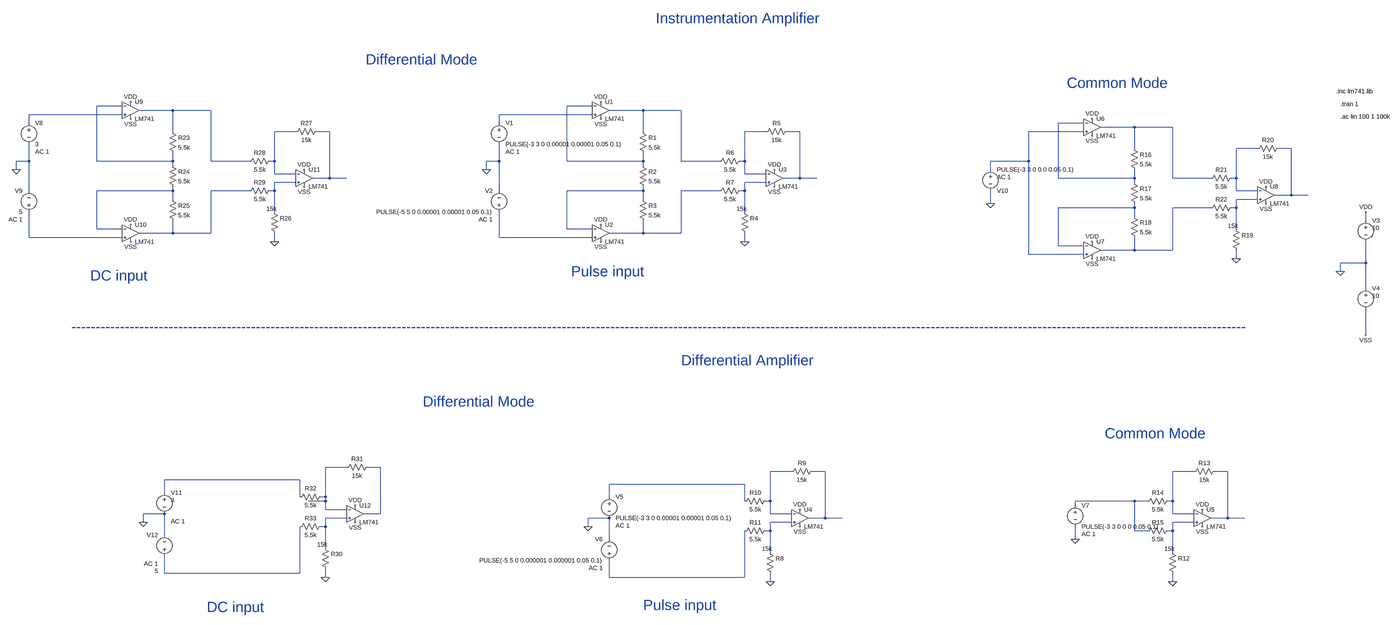
[diagram p0: schematic intrumentation amp.asc, whole sheet]
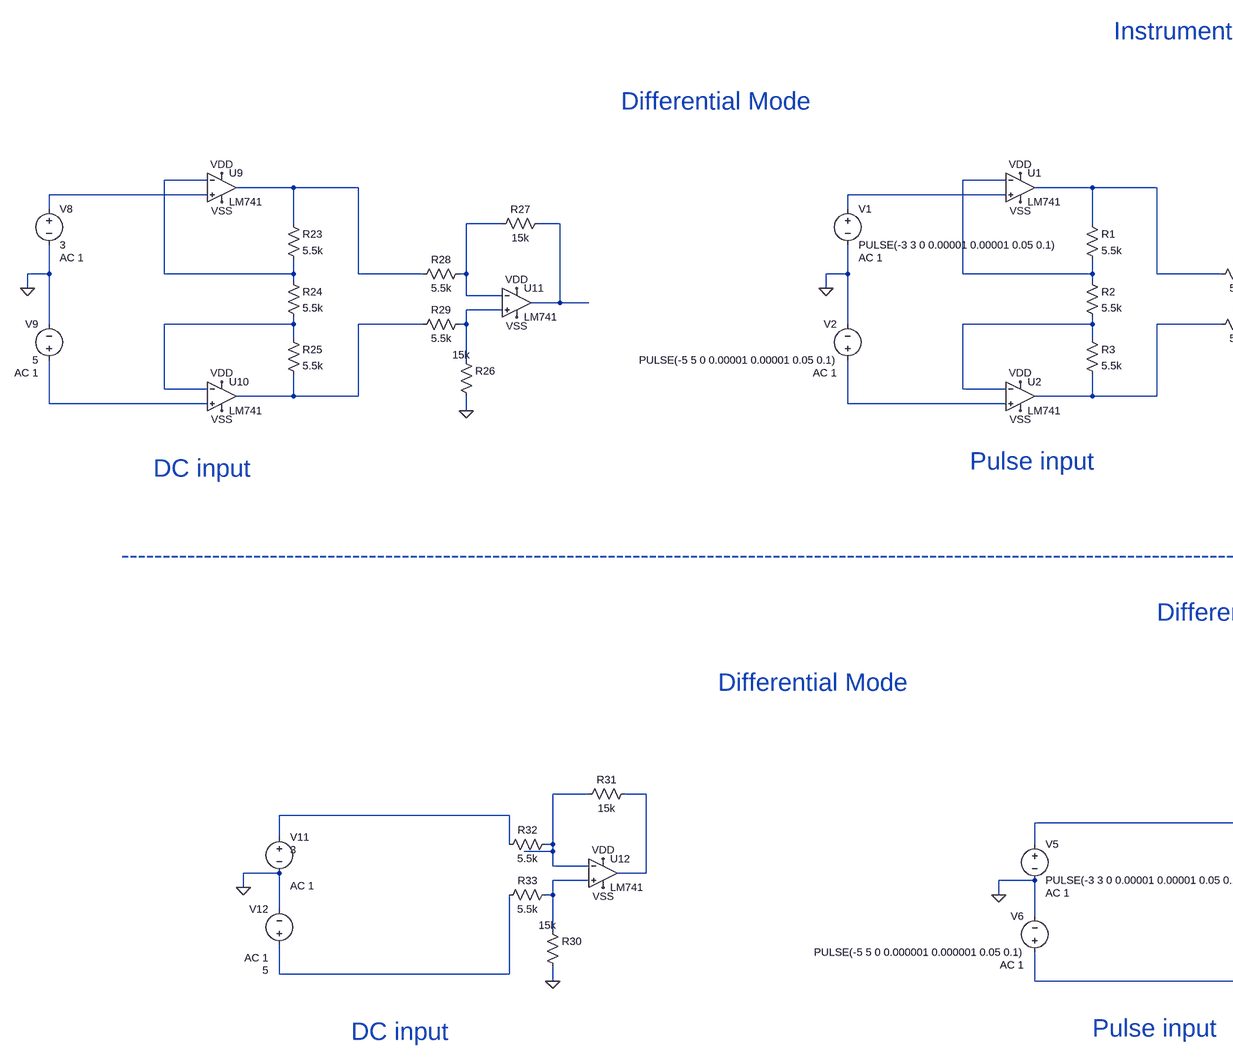
[diagram p1: schematic intrumentation amp.asc, part, row 1 of 1, column 1 of 2]
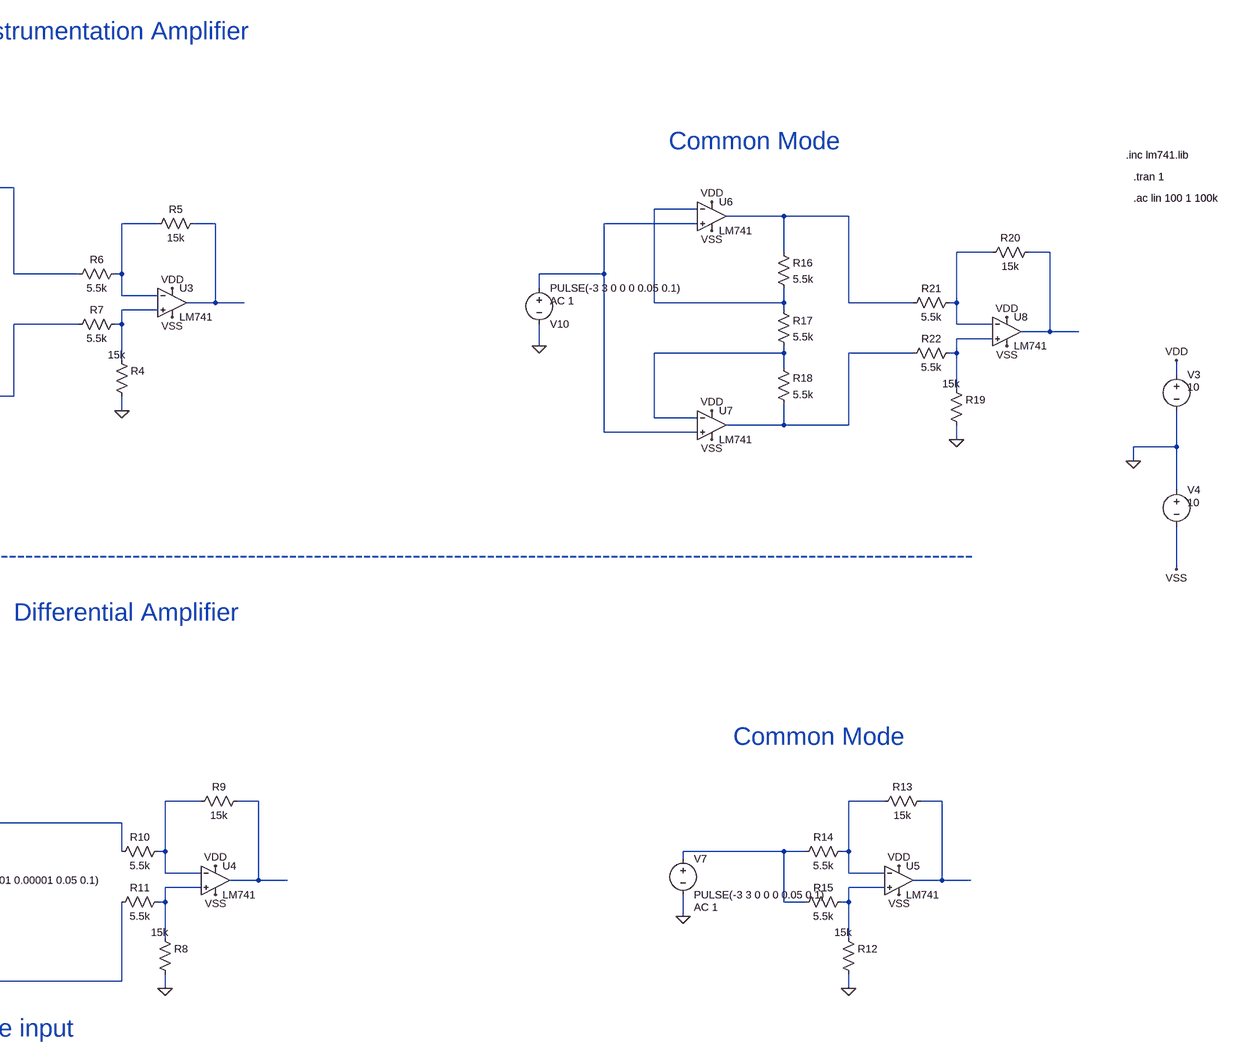
[diagram p2: schematic intrumentation amp.asc, part, row 1 of 1, column 2 of 2]
intrumentation amp.asc, the LTspice schematic file:
Version 4
SHEET 1 4928 2164
WIRE -1456 128 -1552 128
WIRE 320 128 224 128
WIRE -1264 144 -1392 144
WIRE -1120 144 -1264 144
WIRE 512 144 384 144
WIRE 656 144 512 144
WIRE -1456 160 -1808 160
WIRE 320 160 -32 160
WIRE -1808 192 -1808 160
WIRE -32 192 -32 160
WIRE 2176 192 2080 192
WIRE 2368 208 2240 208
WIRE 2512 208 2368 208
WIRE -1264 224 -1264 144
WIRE -800 224 -880 224
WIRE -672 224 -720 224
WIRE 512 224 512 144
WIRE 976 224 896 224
WIRE 1104 224 1056 224
WIRE 2176 224 1968 224
WIRE 2368 288 2368 208
WIRE 2832 288 2752 288
WIRE 2960 288 2912 288
WIRE -1808 336 -1808 272
WIRE -1808 336 -1856 336
WIRE -1552 336 -1552 128
WIRE -1264 336 -1264 304
WIRE -1264 336 -1552 336
WIRE -1120 336 -1120 144
WIRE -976 336 -1120 336
WIRE -880 336 -880 224
WIRE -880 336 -896 336
WIRE -32 336 -32 272
WIRE -32 336 -80 336
WIRE 224 336 224 128
WIRE 512 336 512 304
WIRE 512 336 224 336
WIRE 656 336 656 144
WIRE 800 336 656 336
WIRE 896 336 896 224
WIRE 896 336 880 336
WIRE 1968 336 1968 224
WIRE 1968 336 1824 336
WIRE -1264 352 -1264 336
WIRE 512 352 512 336
WIRE -1856 368 -1856 336
WIRE -80 368 -80 336
WIRE 1824 368 1824 336
WIRE -880 384 -880 336
WIRE -800 384 -880 384
WIRE 896 384 896 336
WIRE 976 384 896 384
WIRE -672 400 -672 224
WIRE -672 400 -736 400
WIRE -608 400 -672 400
WIRE 1104 400 1104 224
WIRE 1104 400 1040 400
WIRE 1168 400 1104 400
WIRE 2080 400 2080 192
WIRE 2368 400 2368 368
WIRE 2368 400 2080 400
WIRE 2512 400 2512 208
WIRE 2656 400 2512 400
WIRE 2752 400 2752 288
WIRE 2752 400 2736 400
WIRE -800 416 -880 416
WIRE 976 416 896 416
WIRE 2368 416 2368 400
WIRE -1808 448 -1808 336
WIRE -1264 448 -1264 432
WIRE -1264 448 -1552 448
WIRE -976 448 -1120 448
WIRE -880 448 -880 416
WIRE -880 448 -896 448
WIRE -32 448 -32 336
WIRE 512 448 512 432
WIRE 512 448 224 448
WIRE 800 448 656 448
WIRE 896 448 896 416
WIRE 896 448 880 448
WIRE 2752 448 2752 400
WIRE 2832 448 2752 448
WIRE 2960 464 2960 288
WIRE 2960 464 2896 464
WIRE 3024 464 2960 464
WIRE -1264 480 -1264 448
WIRE 512 480 512 448
WIRE 2832 480 2752 480
WIRE 1824 496 1824 448
WIRE 2368 512 2368 496
WIRE 2368 512 2080 512
WIRE 2656 512 2512 512
WIRE 2752 512 2752 480
WIRE 2752 512 2736 512
WIRE -880 528 -880 448
WIRE 896 528 896 448
WIRE 2368 544 2368 512
WIRE 3408 560 3408 528
WIRE -1552 592 -1552 448
WIRE -1456 592 -1552 592
WIRE 224 592 224 448
WIRE 320 592 224 592
WIRE 2752 592 2752 512
WIRE -1264 608 -1264 560
WIRE -1264 608 -1392 608
WIRE -1120 608 -1120 448
WIRE -1120 608 -1264 608
WIRE 512 608 512 560
WIRE 512 608 384 608
WIRE 656 608 656 448
WIRE 656 608 512 608
WIRE -1808 624 -1808 528
WIRE -1456 624 -1808 624
WIRE -32 624 -32 528
WIRE 320 624 -32 624
WIRE -880 640 -880 608
WIRE 896 640 896 608
WIRE 2080 656 2080 512
WIRE 2176 656 2080 656
WIRE 2368 672 2368 624
WIRE 2368 672 2240 672
WIRE 2512 672 2512 512
WIRE 2512 672 2368 672
WIRE 1968 688 1968 336
WIRE 2176 688 1968 688
WIRE 2752 704 2752 672
WIRE 3408 720 3408 640
WIRE 3408 720 3312 720
WIRE 3312 752 3312 720
WIRE 3408 816 3408 720
WIRE 3408 992 3408 896
WIRE -608 1600 -688 1600
WIRE -480 1600 -528 1600
WIRE 1072 1616 992 1616
WIRE 1200 1616 1152 1616
WIRE 2592 1616 2512 1616
WIRE 2720 1616 2672 1616
WIRE -784 1648 -1296 1648
WIRE 896 1664 384 1664
WIRE -1296 1696 -1296 1648
WIRE -784 1712 -784 1648
WIRE -688 1712 -688 1600
WIRE -688 1712 -704 1712
WIRE 384 1712 384 1664
WIRE -688 1728 -688 1712
WIRE -688 1728 -752 1728
WIRE 896 1728 896 1664
WIRE 992 1728 992 1616
WIRE 992 1728 976 1728
WIRE 2368 1728 2144 1728
WIRE 2416 1728 2368 1728
WIRE 2512 1728 2512 1616
WIRE 2512 1728 2496 1728
WIRE 2144 1744 2144 1728
WIRE -688 1760 -688 1728
WIRE -608 1760 -688 1760
WIRE -1296 1776 -1376 1776
WIRE -480 1776 -480 1600
WIRE -480 1776 -544 1776
WIRE 992 1776 992 1728
WIRE 1072 1776 992 1776
WIRE 2512 1776 2512 1728
WIRE 2592 1776 2512 1776
WIRE -608 1792 -688 1792
WIRE 384 1792 304 1792
WIRE 1200 1792 1200 1616
WIRE 1200 1792 1136 1792
WIRE 1264 1792 1200 1792
WIRE 2720 1792 2720 1616
WIRE 2720 1792 2656 1792
WIRE 2784 1792 2720 1792
WIRE -1376 1808 -1376 1776
WIRE 1072 1808 992 1808
WIRE 2592 1808 2512 1808
WIRE -688 1824 -688 1792
WIRE -688 1824 -704 1824
WIRE 304 1824 304 1792
WIRE 992 1840 992 1808
WIRE 992 1840 976 1840
WIRE 2368 1840 2368 1728
WIRE 2416 1840 2368 1840
WIRE 2512 1840 2512 1808
WIRE 2512 1840 2496 1840
WIRE -1296 1856 -1296 1776
WIRE 384 1872 384 1792
WIRE 2144 1872 2144 1824
WIRE -688 1904 -688 1824
WIRE 992 1920 992 1840
WIRE 2512 1920 2512 1840
WIRE -1296 2000 -1296 1936
WIRE -784 2000 -784 1824
WIRE -784 2000 -1296 2000
WIRE -688 2016 -688 1984
WIRE 384 2016 384 1952
WIRE 896 2016 896 1840
WIRE 896 2016 384 2016
WIRE 992 2032 992 2000
WIRE 2512 2032 2512 2000
FLAG 896 640 0
FLAG -80 368 0
FLAG 3312 752 0
FLAG 3408 528 VDD
FLAG 352 112 VDD
FLAG 352 576 VDD
FLAG 1008 368 VDD
FLAG 3408 992 VSS
FLAG 352 640 VSS
FLAG 352 176 VSS
FLAG 1008 432 VSS
FLAG 992 2032 0
FLAG 1104 1760 VDD
FLAG 1104 1824 VSS
FLAG 304 1824 0
FLAG 2512 2032 0
FLAG 2624 1760 VDD
FLAG 2624 1824 VSS
FLAG 2752 704 0
FLAG 2208 176 VDD
FLAG 2208 640 VDD
FLAG 2864 432 VDD
FLAG 2208 704 VSS
FLAG 2208 240 VSS
FLAG 2864 496 VSS
FLAG 1824 496 0
FLAG 2144 1872 0
FLAG -880 640 0
FLAG -1856 368 0
FLAG -1424 112 VDD
FLAG -1424 576 VDD
FLAG -768 368 VDD
FLAG -1424 640 VSS
FLAG -1424 176 VSS
FLAG -768 432 VSS
FLAG -688 2016 0
FLAG -576 1744 VDD
FLAG -576 1808 VSS
FLAG -1376 1808 0
SYMBOL OpAmps\\opamp2 352 80 R0
SYMATTR InstName U1
SYMATTR Value LM741
SYMBOL OpAmps\\opamp2 352 544 R0
SYMATTR InstName U2
SYMATTR Value LM741
SYMBOL OpAmps\\opamp2 1008 336 R0
SYMATTR InstName U3
SYMATTR Value LM741
SYMBOL res 496 208 R0
SYMATTR InstName R1
SYMATTR Value 5.5k
SYMBOL res 496 336 R0
SYMATTR InstName R2
SYMATTR Value 5.5k
SYMBOL res 496 464 R0
SYMATTR InstName R3
SYMATTR Value 5.5k
SYMBOL res 880 512 R0
WINDOW 3 -15 4 Left 2
SYMATTR Value 15k
SYMATTR InstName R4
SYMBOL res 1072 208 R90
WINDOW 0 0 56 VBottom 2
WINDOW 3 32 56 VTop 2
SYMATTR InstName R5
SYMATTR Value 15k
SYMBOL res 896 320 R90
WINDOW 0 0 56 VBottom 2
WINDOW 3 32 56 VTop 2
SYMATTR InstName R6
SYMATTR Value 5.5k
SYMBOL res 896 432 R90
WINDOW 0 0 56 VBottom 2
WINDOW 3 32 56 VTop 2
SYMATTR InstName R7
SYMATTR Value 5.5k
SYMBOL voltage -32 176 R0
WINDOW 123 24 124 Left 2
WINDOW 39 0 0 Left 0
SYMATTR Value2 AC 1
SYMATTR InstName V1
SYMATTR Value PULSE(-3 3 0 0.00001 0.00001 0.05 0.1)
SYMBOL voltage -32 544 R180
WINDOW 0 24 96 Left 2
WINDOW 3 24 16 Left 2
WINDOW 123 24 -12 Left 2
WINDOW 39 0 0 Left 0
SYMATTR InstName V2
SYMATTR Value PULSE(-5 5 0 0.00001 0.00001 0.05 0.1)
SYMATTR Value2 AC 1
SYMBOL voltage 3408 544 R0
WINDOW 123 0 0 Left 0
WINDOW 39 0 0 Left 0
WINDOW 3 24 44 Left 2
SYMATTR Value 10
SYMATTR InstName V3
SYMBOL voltage 3408 800 R0
WINDOW 123 0 0 Left 0
WINDOW 39 0 0 Left 0
WINDOW 3 24 44 Left 2
SYMATTR Value 10
SYMATTR InstName V4
SYMBOL OpAmps\\opamp2 1104 1728 R0
SYMATTR InstName U4
SYMATTR Value LM741
SYMBOL res 976 1904 R0
WINDOW 3 -15 4 Left 2
SYMATTR Value 15k
SYMATTR InstName R8
SYMBOL res 1168 1600 R90
WINDOW 0 0 56 VBottom 2
WINDOW 3 32 56 VTop 2
SYMATTR InstName R9
SYMATTR Value 15k
SYMBOL res 992 1712 R90
WINDOW 0 0 56 VBottom 2
WINDOW 3 32 56 VTop 2
SYMATTR InstName R10
SYMATTR Value 5.5k
SYMBOL res 992 1824 R90
WINDOW 0 0 56 VBottom 2
WINDOW 3 32 56 VTop 2
SYMATTR InstName R11
SYMATTR Value 5.5k
SYMBOL voltage 384 1696 R0
WINDOW 123 24 124 Left 2
WINDOW 39 0 0 Left 0
SYMATTR Value2 AC 1
SYMATTR InstName V5
SYMATTR Value PULSE(-3 3 0 0.00001 0.00001 0.05 0.1)
SYMBOL voltage 384 1968 R180
WINDOW 0 24 96 Left 2
WINDOW 3 24 16 Left 2
WINDOW 123 24 -12 Left 2
WINDOW 39 0 0 Left 0
SYMATTR InstName V6
SYMATTR Value PULSE(-5 5 0 0.000001 0.000001 0.05 0.1)
SYMATTR Value2 AC 1
SYMBOL OpAmps\\opamp2 2624 1728 R0
SYMATTR InstName U5
SYMATTR Value LM741
SYMBOL res 2496 1904 R0
WINDOW 3 -15 4 Left 2
SYMATTR Value 15k
SYMATTR InstName R12
SYMBOL res 2688 1600 R90
WINDOW 0 0 56 VBottom 2
WINDOW 3 32 56 VTop 2
SYMATTR InstName R13
SYMATTR Value 15k
SYMBOL res 2512 1712 R90
WINDOW 0 0 56 VBottom 2
WINDOW 3 32 56 VTop 2
SYMATTR InstName R14
SYMATTR Value 5.5k
SYMBOL res 2512 1824 R90
WINDOW 0 0 56 VBottom 2
WINDOW 3 32 56 VTop 2
SYMATTR InstName R15
SYMATTR Value 5.5k
SYMBOL OpAmps\\opamp2 2208 144 R0
SYMATTR InstName U6
SYMATTR Value LM741
SYMBOL OpAmps\\opamp2 2208 608 R0
SYMATTR InstName U7
SYMATTR Value LM741
SYMBOL OpAmps\\opamp2 2864 400 R0
SYMATTR InstName U8
SYMATTR Value LM741
SYMBOL res 2352 272 R0
SYMATTR InstName R16
SYMATTR Value 5.5k
SYMBOL res 2352 400 R0
SYMATTR InstName R17
SYMATTR Value 5.5k
SYMBOL res 2352 528 R0
SYMATTR InstName R18
SYMATTR Value 5.5k
SYMBOL res 2736 576 R0
WINDOW 3 -15 4 Left 2
SYMATTR Value 15k
SYMATTR InstName R19
SYMBOL res 2928 272 R90
WINDOW 0 0 56 VBottom 2
WINDOW 3 32 56 VTop 2
SYMATTR InstName R20
SYMATTR Value 15k
SYMBOL res 2752 384 R90
WINDOW 0 0 56 VBottom 2
WINDOW 3 32 56 VTop 2
SYMATTR InstName R21
SYMATTR Value 5.5k
SYMBOL res 2752 496 R90
WINDOW 0 0 56 VBottom 2
WINDOW 3 32 56 VTop 2
SYMATTR InstName R22
SYMATTR Value 5.5k
SYMBOL voltage 1824 352 R0
WINDOW 0 24 96 Left 2
WINDOW 3 24 16 Left 2
WINDOW 123 24 44 Left 2
WINDOW 39 0 0 Left 0
SYMATTR InstName V10
SYMATTR Value PULSE(-3 3 0 0 0 0.05 0.1)
SYMATTR Value2 AC 1
SYMBOL voltage 2144 1728 R0
WINDOW 123 24 124 Left 2
WINDOW 39 0 0 Left 0
SYMATTR Value2 AC 1
SYMATTR InstName V7
SYMATTR Value PULSE(-3 3 0 0 0 0.05 0.1)
SYMBOL OpAmps\\opamp2 -1424 80 R0
SYMATTR InstName U9
SYMATTR Value LM741
SYMBOL OpAmps\\opamp2 -1424 544 R0
SYMATTR InstName U10
SYMATTR Value LM741
SYMBOL OpAmps\\opamp2 -768 336 R0
SYMATTR InstName U11
SYMATTR Value LM741
SYMBOL res -1280 208 R0
SYMATTR InstName R23
SYMATTR Value 5.5k
SYMBOL res -1280 336 R0
SYMATTR InstName R24
SYMATTR Value 5.5k
SYMBOL res -1280 464 R0
SYMATTR InstName R25
SYMATTR Value 5.5k
SYMBOL res -896 512 R0
WINDOW 3 -15 4 Left 2
SYMATTR Value 15k
SYMATTR InstName R26
SYMBOL res -704 208 R90
WINDOW 0 0 56 VBottom 2
WINDOW 3 32 56 VTop 2
SYMATTR InstName R27
SYMATTR Value 15k
SYMBOL res -880 320 R90
WINDOW 0 0 56 VBottom 2
WINDOW 3 32 56 VTop 2
SYMATTR InstName R28
SYMATTR Value 5.5k
SYMBOL res -880 432 R90
WINDOW 0 0 56 VBottom 2
WINDOW 3 32 56 VTop 2
SYMATTR InstName R29
SYMATTR Value 5.5k
SYMBOL voltage -1808 176 R0
WINDOW 123 24 124 Left 2
WINDOW 39 0 0 Left 0
SYMATTR Value2 AC 1
SYMATTR InstName V8
SYMATTR Value 3
SYMBOL voltage -1808 544 R180
WINDOW 0 24 96 Left 2
WINDOW 3 24 16 Left 2
WINDOW 123 24 -12 Left 2
WINDOW 39 0 0 Left 0
SYMATTR InstName V9
SYMATTR Value 5
SYMATTR Value2 AC 1
SYMBOL OpAmps\\opamp2 -576 1712 R0
SYMATTR InstName U12
SYMATTR Value LM741
SYMBOL res -704 1888 R0
WINDOW 3 -15 4 Left 2
SYMATTR Value 15k
SYMATTR InstName R30
SYMBOL res -512 1584 R90
WINDOW 0 0 56 VBottom 2
WINDOW 3 32 56 VTop 2
SYMATTR InstName R31
SYMATTR Value 15k
SYMBOL res -688 1696 R90
WINDOW 0 0 56 VBottom 2
WINDOW 3 32 56 VTop 2
SYMATTR InstName R32
SYMATTR Value 5.5k
SYMBOL res -688 1808 R90
WINDOW 0 0 56 VBottom 2
WINDOW 3 32 56 VTop 2
SYMATTR InstName R33
SYMATTR Value 5.5k
SYMBOL voltage -1296 1680 R0
WINDOW 123 24 124 Left 2
WINDOW 39 0 0 Left 0
WINDOW 3 24 44 Left 2
SYMATTR Value2 AC 1
SYMATTR Value 3
SYMATTR InstName V11
SYMBOL voltage -1296 1952 R180
WINDOW 0 24 96 Left 2
WINDOW 3 24 -40 Left 2
WINDOW 123 24 -12 Left 2
WINDOW 39 0 0 Left 0
SYMATTR InstName V12
SYMATTR Value 5
SYMATTR Value2 AC 1
TEXT 3296 72 Left 2 !.inc lm741.lib
TEXT 3312 120 Left 2 !.tran 1
TEXT -1648 960 Left 5 ;--------------------------------------------------------------------------------------------------------------------------------------------------------------------------------------------------------------------------------------------------
TEXT 560 -376 Left 5 ;Instrumentation Amplifier
TEXT -536 -48 Left 5 ;Differential Mode
TEXT -320 1352 Left 5 ;Differential Mode
TEXT 656 1088 Left 5 ;Differential Amplifier
TEXT 2256 1472 Left 5 ;Common Mode
TEXT 2112 40 Left 5 ;Common Mode
TEXT 3312 168 Left 2 !.ac lin 100 1 100k
TEXT -1576 768 Left 5 ;DC input
TEXT 240 752 Left 5 ;Pulse input
TEXT -1136 2128 Left 5 ;DC input
TEXT 512 2120 Left 5 ;Pulse input

The netlist it stands for:
* intrumentation amp.asc
XU1 N006 N002 VDD VSS N004 LM741  ; pins In+ In- V+ V- OUT
XU2 N026 N020 VDD VSS N021 LM741  ; pins In+ In- V+ V- OUT
XU3 N017 N011 VDD VSS N012 LM741  ; pins In+ In- V+ V- OUT
R1 N004 N002 5.5k
R2 N002 N020 5.5k
R3 N020 N021 5.5k
R4 N017 0 15k
R5 N012 N011 15k
R6 N011 N004 5.5k
R7 N017 N021 5.5k
V1 N006 0 PULSE(-3 3 0 0.00001 0.00001 0.05 0.1) AC 1
V2 N026 0 PULSE(-5 5 0 0.00001 0.00001 0.05 0.1) AC 1
V3 VDD 0 10
V4 0 VSS 10
XU4 N037 N029 VDD VSS N030 LM741  ; pins In+ In- V+ V- OUT
R8 N037 0 15k
R9 N030 N029 15k
R10 N029 N034 5.5k
R11 N037 N040 5.5k
V5 N034 0 PULSE(-3 3 0 0.00001 0.00001 0.05 0.1) AC 1
V6 N040 0 PULSE(-5 5 0 0.000001 0.000001 0.05 0.1) AC 1
XU5 N038 N031 VDD VSS N032 LM741  ; pins In+ In- V+ V- OUT
R12 N038 0 15k
R13 N032 N031 15k
R14 N031 N035 5.5k
R15 N038 N035 5.5k
XU6 N013 N007 VDD VSS N008 LM741  ; pins In+ In- V+ V- OUT
XU7 N013 N023 VDD VSS N024 LM741  ; pins In+ In- V+ V- OUT
XU8 N022 N014 VDD VSS N015 LM741  ; pins In+ In- V+ V- OUT
R16 N008 N007 5.5k
R17 N007 N023 5.5k
R18 N023 N024 5.5k
R19 N022 0 15k
R20 N015 N014 15k
R21 N014 N008 5.5k
R22 N022 N024 5.5k
V10 N013 0 PULSE(-3 3 0 0 0 0.05 0.1) AC 1
V7 N035 0 PULSE(-3 3 0 0 0 0.05 0.1) AC 1
XU9 N005 N001 VDD VSS N003 LM741  ; pins In+ In- V+ V- OUT
XU10 N025 N018 VDD VSS N019 LM741  ; pins In+ In- V+ V- OUT
XU11 N016 N009 VDD VSS N010 LM741  ; pins In+ In- V+ V- OUT
R23 N003 N001 5.5k
R24 N001 N018 5.5k
R25 N018 N019 5.5k
R26 N016 0 15k
R27 N010 N009 15k
R28 N009 N003 5.5k
R29 N016 N019 5.5k
V8 N005 0 3 AC 1
V9 N025 0 5 AC 1
XU12 N036 N027 VDD VSS N028 LM741  ; pins In+ In- V+ V- OUT
R30 N036 0 15k
R31 N028 N027 15k
R32 N027 N033 5.5k
R33 N036 N039 5.5k
V11 N033 0 3 AC 1
V12 N039 0 5 AC 1
.inc lm741.lib
.tran 1
* --------------------------------------------------------------------------------------------------------------------------------------------------------------------------------------------------------------------------------------------------
* Instrumentation Amplifier
* Differential Mode
* Differential Mode
* Differential Amplifier
* Common Mode
* Common Mode
.ac lin 100 1 100k
* DC input
* Pulse input
* DC input
* Pulse input
.backanno
.end